# EAGLE design powresupply (EAGLE 7.5.0)
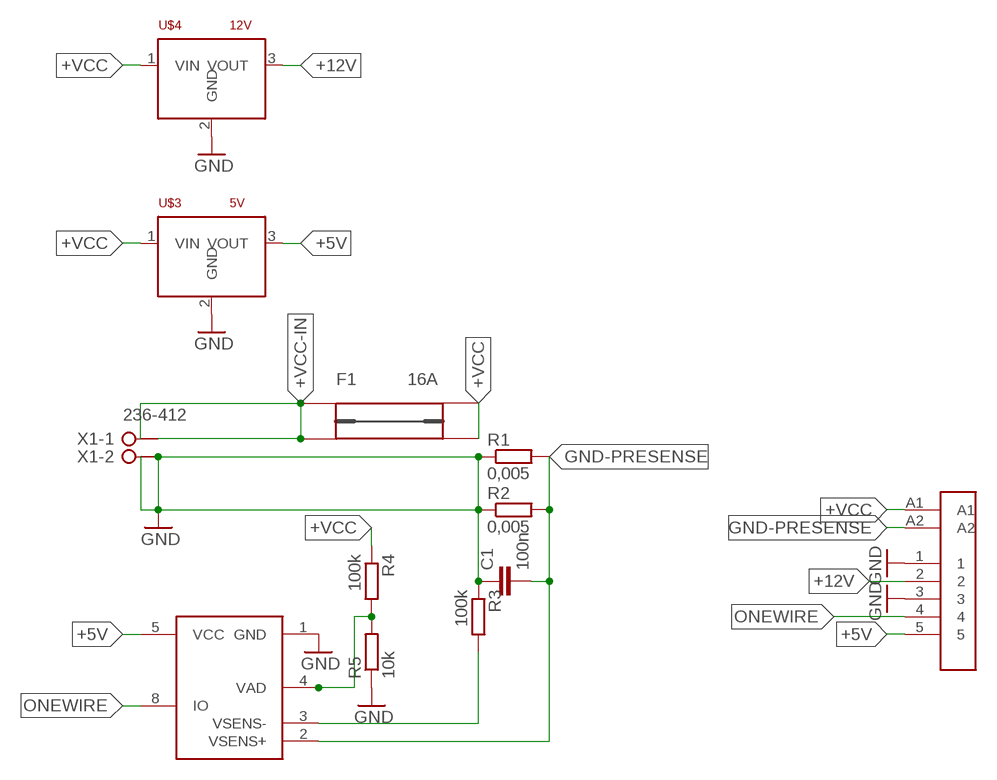
[diagram p0: schematic, sheet 1]

## Parts
C1  100n  C-EUC0805  [C0805]
F1  16A  BUSSMANN10X38  [1A3400]
R1  0,005  R-EU_R2512  [R2512]
R2  0,005  R-EU_R2512  [R2512]
R3  100k  R-EU_R0805  [R0805]
R4  100k  R-EU_R0805  [R0805]
R5  10k  R-EU_R0805  [R0805]
U$1  7W2-F  [7W2-F]
U$2  DS2438  [SO-08]
U$3  5V  RECOM  [RECOM]
U$4  12V  RECOM  [RECOM]
X1  236-412  [236-412]

## Nets
+5V: U$1.5 U$2.5(VCC) U$3.3(VOUT)
+12V: U$1.2 U$4.3(VOUT)
+VCC: F1.P$3 F1.P$4 R4.1 U$1.A1 U$3.1(VIN) U$4.1(VIN)
+VCC-IN: F1.P$1 F1.P$2 X1.1@1(-1:KL1) X1.1@2(-1:KL2)
GND: C1.1 R1.1 R2.1 R3.1 R5.1 U$1.1 U$1.3 U$2.1(GND) U$3.2(GND) U$4.2(GND) X1.2@1(-2:KL1) X1.2@2(-2:KL2)
GND-PRESENSE: C1.2 R1.2 R2.2 U$1.A2 U$2.2(VSENS+)
N$5: R4.2 R5.2 U$2.4(VAD)
N$8: R3.2 U$2.3(VSENS-)
ONEWIRE: U$1.4 U$2.8(IO)

## Library data of the parts
C1 = rcl:C-EU: CAPACITOR, European symbol
F1 = custom:BUSSMANN10X38
R1-R5 = rcl:R-EU_: RESISTOR, European symbol
U$1 = conec:7W2-F
U$2 = custom:DS2438
U$3 U$4 = custom:RECOM
X1 = custom:236-412: Terminal Strips 2.5 mm2/AWG 12, Series 236, Pin Spacings 5/5.08 mm Source: Data sheet <http://www.farnell.com/datasheets/63479.pdf>; MF: Wago Corporation; MPN: 0236-0412; OC_FARNELL: 1283531; OC_NEWARK: 79K2064

## Board
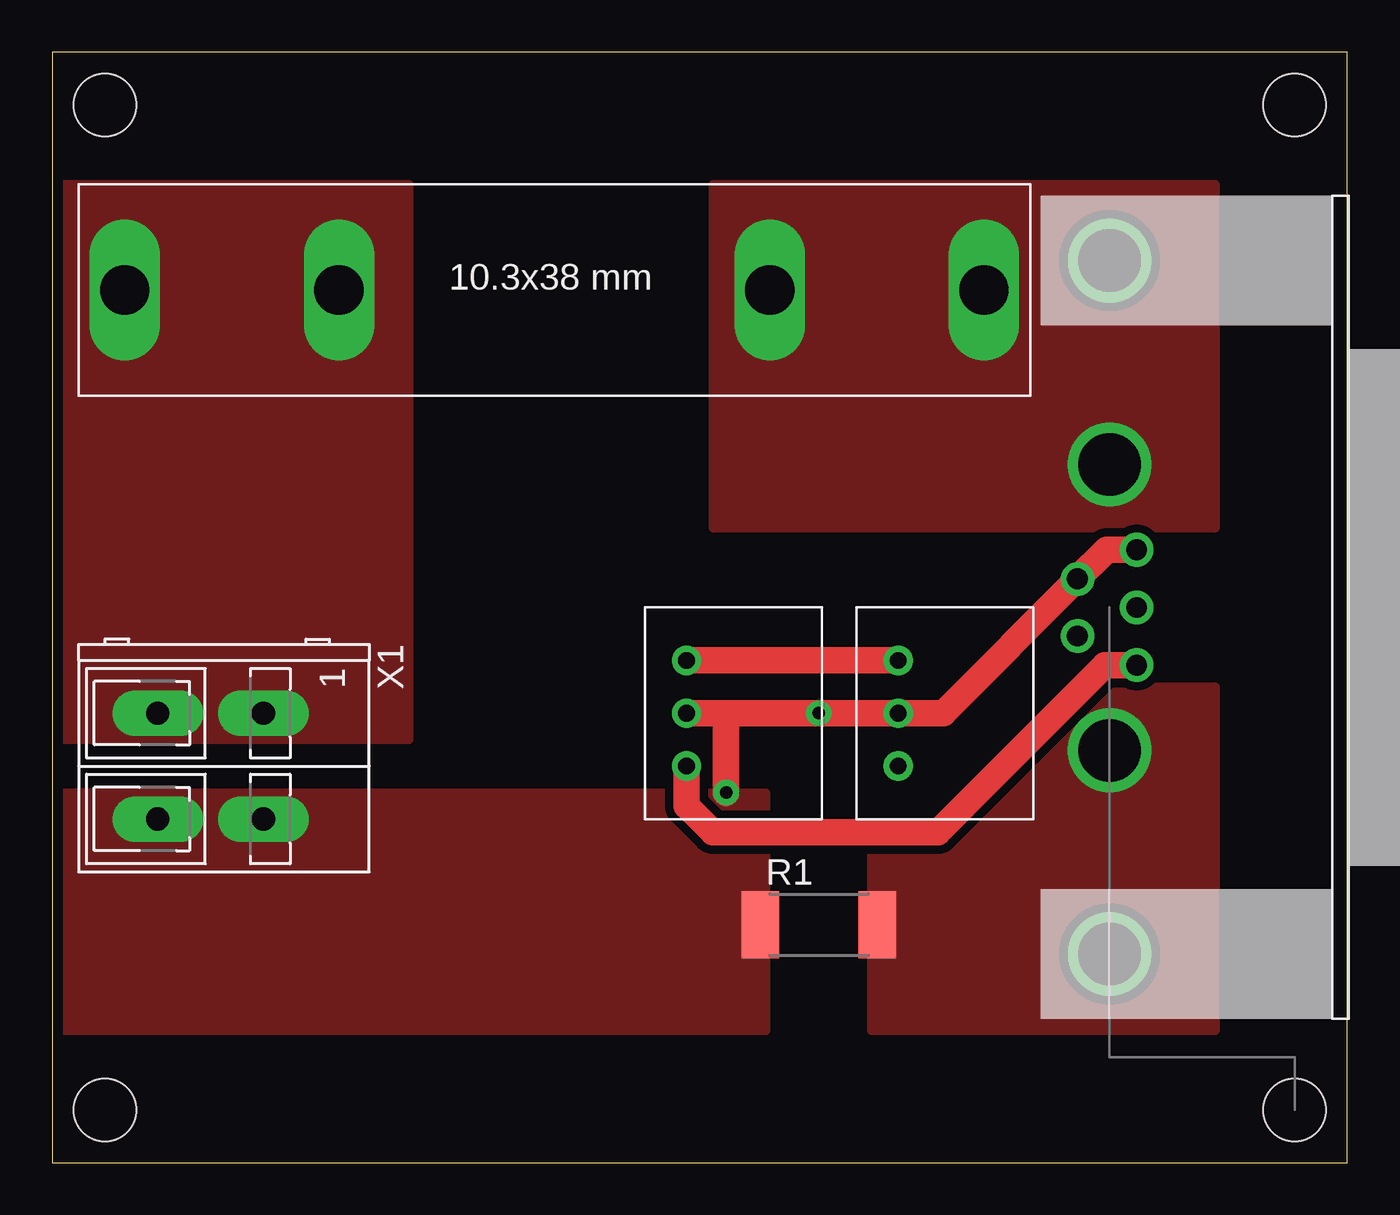
[diagram p1: board, top side]
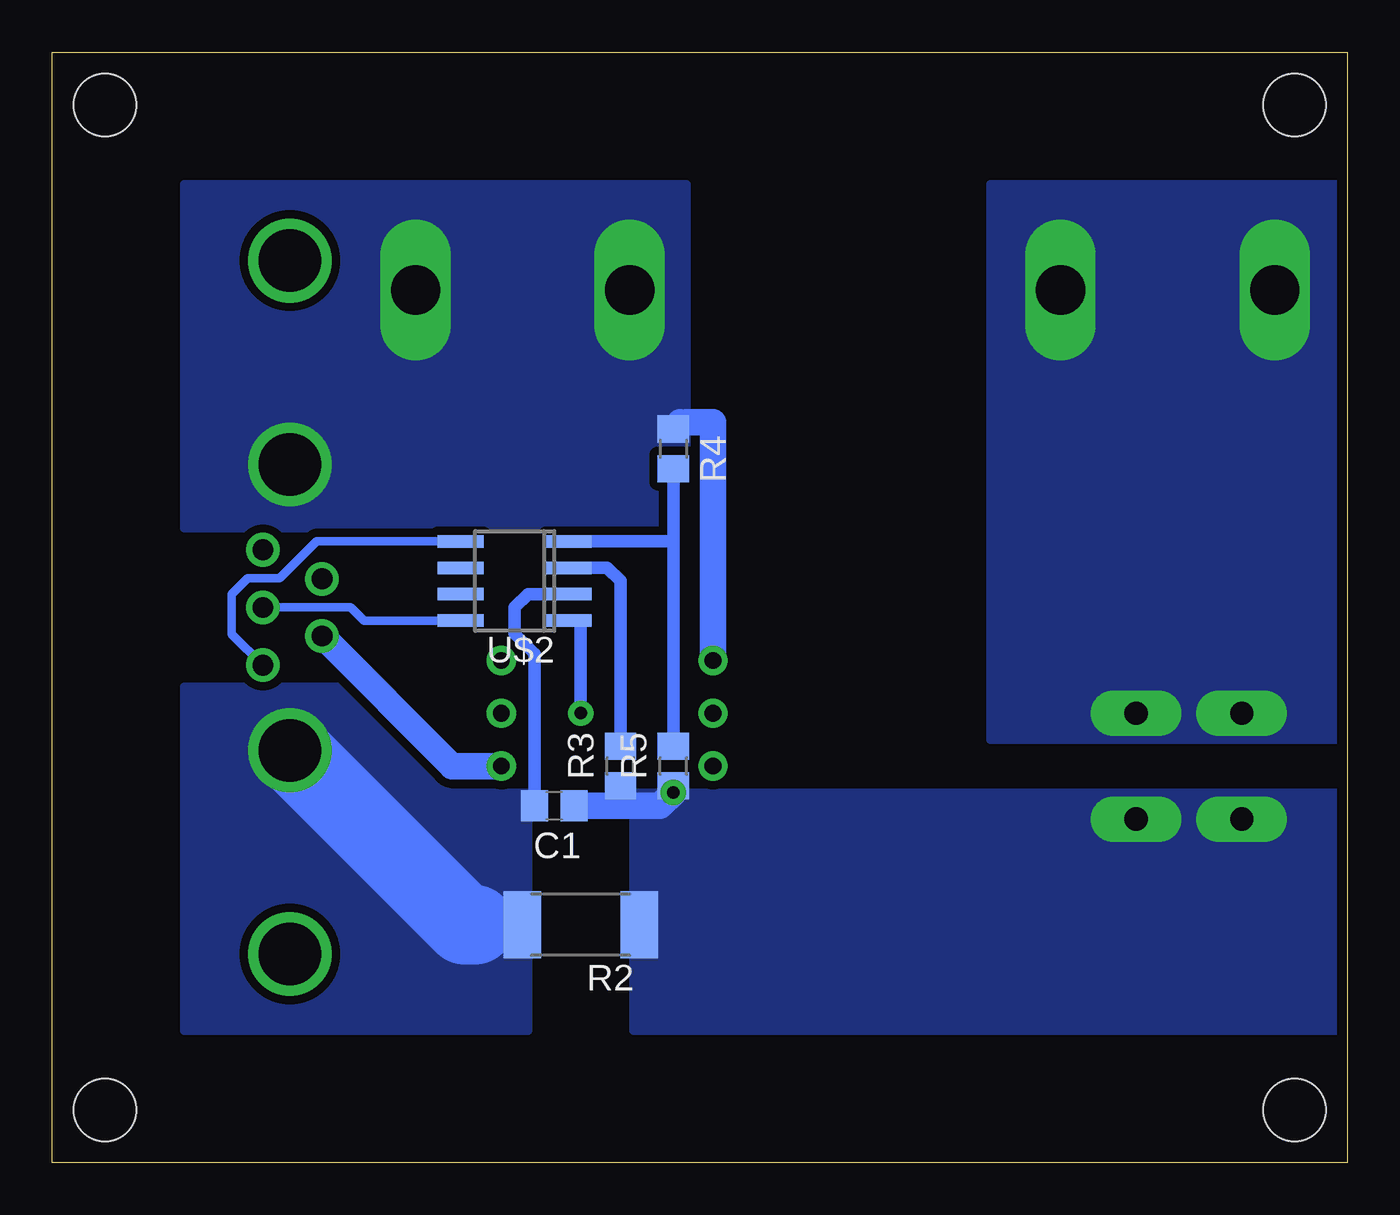
[diagram p2: board, bottom side, seen from below]

Size 62.23 x 53.34 mm. Coordinates in mm from the lower left corner, seen from the top.
Outline: 0,0 62.23,0 62.23,53.34 0,53.34 0,0
Copper layers (1*16): Top 0.035mm / dielectric 1.5mm / Bottom 0.035mm
Design rules "Standard12_lpt *": minimum track width 12mil, minimum drill 16mil, track to track 12mil, track to pad 12mil, pad to pad 12mil, via to via 12mil, smd to smd 0mil, copper to edge 20mil, drill to drill 8mil, minimum pad ring 12mil, minimum via ring 12mil, stop-mask expansion 4mil, vias tented up to drill 0mil, thermal gap 10mil
Holes 3 mm at 59.69,2.54 59.69,50.8 2.54,50.8 2.54,2.54

### Footprints (pad centres in the part's own frame; a part is rotated, then mirrored left to right if it is on the bottom)
C0805 = smd 1.3 x 1.5: 1 -0.95,0; 2 0.95,0
1A3400 = drill 2.362 long: P$1 -20.637,0; P$2 -10.351,0; P$3 10.351,0; P$4 20.637,0
R2512 = smd 1.8 x 3.2: 1 -2.8,0; 2 2.8,0
R0805 = smd 1.3 x 1.5: 1 -0.95,0; 2 0.95,0
7W2-F = drill 1: 1 1.37,1.54; 2 -1.37,1.54; 3 2.77,-1.3; 4 0,-1.3; 5 -2.77,-1.3 | drill 3: A1 6.86,0; A2 -6.86,0; P$1 -16.65,0; P$2 16.65,0
SO-08 = smd 0.6 x 2.2: 1 -1.905,-2.6; 2 -0.635,-2.6; 3 0.635,-2.6; 4 1.905,-2.6; 5 1.905,2.6; 6 0.635,2.6; 7 -0.635,2.6; 8 -1.905,2.6
RECOM = drill 0.8: 1 -2.54,0; 2 0,0; 3 2.54,0
236-412 = drill 1.118 pad 2.184 long: 1@1 0,-2.54; 1@2 0,2.54; 2@1 5.08,-2.54; 2@2 5.08,2.54

### Placement (x,y rotation side)
C1  38.1,17.14 180 bottom
F1  24.13,41.91 0 top
R1  36.83,11.43 0 top
R2  36.83,11.43 180 bottom
R3  34.92,19.05 90 bottom
R4  32.38,34.29 270 bottom
R5  32.38,19.05 90 bottom
U$1  50.8,26.67 90 top
U$2  40.01,27.94 90 bottom
U$3  30.48,21.59 270 top
U$4  40.64,21.59 270 top
X1  7.62,21.59 270 top

### Tracks (layer width: path | path; a pad name or v marks a point on that pad's centre or on a via)
+5V
  Top 1.27: U$1.5 50.57,23.9 42.55,15.88 31.75,15.88 30.48,17.14 U$3.3
  Bottom 0.406: U$2.5 49.53,29.84 51.31,28.07 52.83,28.07 53.59,27.3 53.59,25.39 U$1.5
+12V
  Bottom 1.27: U$4.3 43.01,19.05 U$1.2
+VCC
  Top 1.27: U$3.1 U$4.1
  Bottom 0.61: 31.75,35.56 32.06,35.56
  Bottom 1.27: U$3.1 30.48,35.56 31.75,35.56 | 32.06,35.56 R4.1
  pour Top (isolate 0.406, no thermals): 31.75,46.99 55.88,46.99 55.88,30.48 31.75,30.48
  pour Bottom (isolate 0.406, no thermals): 31.75,46.99 55.88,46.99 55.88,30.48 31.75,30.48
+VCC-IN
  pour Bottom (no thermals): 0,20.32 17.14,20.32 17.14,46.99 0,46.99
  pour Top (no thermals): 0,20.32 17.14,20.32 17.14,46.99 0,46.99
GND  (via drill 0.6)
  Top 1.27: 32.38,21.59 v36.83,21.59 U$4.2 42.81,21.59 U$1.1 50.66,29.44 U$1.3 | 32.38,21.59 U$3.2 | 32.38,21.59 v32.38,17.78
  Bottom 0.61: U$2.1 36.83,26.04 v36.83,21.59
  Bottom 1.27: C1.1 34.92,17.14 | 34.92,17.14 33.02,17.14 v32.38,17.78 R5.1 | R3.1 34.92,17.14
  pour Top (isolate 0.406, no thermals): 0,17.78 34.29,17.78 34.29,6.35 0,6.35
  pour Bottom (isolate 0.406, no thermals): 0,17.78 34.29,17.78 34.29,6.35 0,6.35
GND-PRESENSE
  Bottom 0.61: 39.69,11.48 R2.2 | U$2.2 39.37,27.3 40.01,26.67 40.01,25.4 39.05,24.45 C1.2
  Bottom 3.81: 41.91,11.43 42.42,11.43 U$1.A2
  pour Bottom (isolate 0.406, no thermals): 48.26,22.86 43.18,17.78 39.37,17.78 39.37,6.35 55.88,6.35 55.88,22.86
  pour Top (isolate 0.406, no thermals): 48.26,22.86 43.18,17.78 39.37,17.78 39.37,6.35 55.88,6.35 55.88,22.86
N$5
  Bottom 0.61: R5.2 32.38,29.84 | 32.38,29.84 R4.2 | U$2.4 32.38,29.84
N$8
  Bottom 0.61: U$2.3 35.56,28.57 34.92,27.94 R3.2
ONEWIRE
  Bottom 0.406: U$2.8 47.24,26.04 47.88,26.67 U$1.4

### Text on the board
Measures: modular connector